# EAGLE design Gift card (EAGLE 6.5.0)
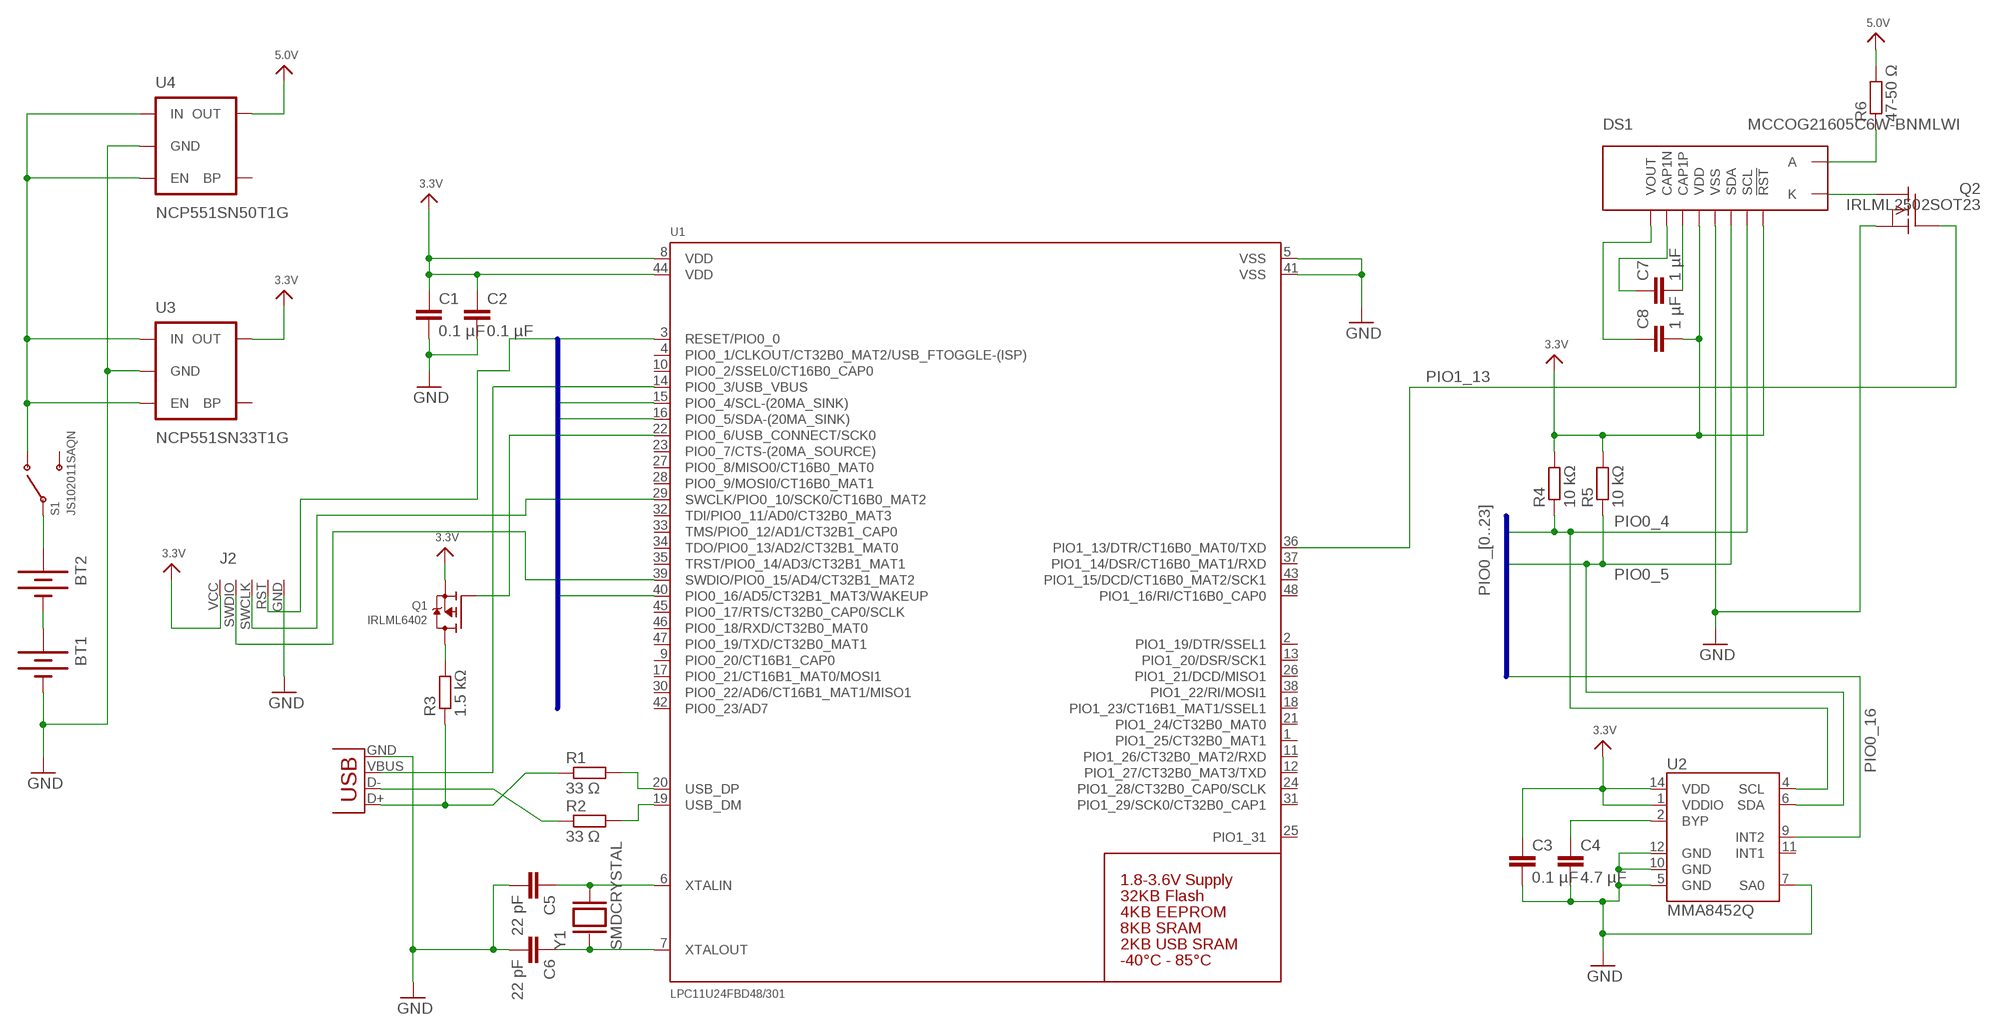
[diagram p0: schematic, sheet 1]

## Parts
BT1  BATTERY20SMD  [BATTCON_20MM]
BT2  BATTERY20SMD  [BATTCON_20MM]
C1  0.1 µF  C-EUC0805  [C0805]
C2  0.1 µF  C-EUC0805  [C0805]
C3  0.1 µF  C-EUC0805  [C0805]
C4  4.7 µF  C-EUC0805  [C0805]
C5  22 pF  C-EUC0805  [C0805]
C6  22 pF  C-EUC0805  [C0805]
C7  1 µF  C-EUC0805  [C0805]
C8  1 µF  C-EUC0805  [C0805]
DS1  MCCOG21605C6W-BNMLWI  [MCCOG21605C6W-BNMLWI]
J1  USBSMD  [USB-MINIB]
J2  LPC_SWD_PINPROG  [LPC_SWD_PINS]
Q1  IRLML6402  MOSFET-PWIDE  [SOT23-WIDE]
Q2  IRLML2502SOT23  [SOT23-3]
R1  33 Ω  R-EU_R0805  [R0805]
R2  33 Ω  R-EU_R0805  [R0805]
R3  1.5 kΩ  R-EU_R0805  [R0805]
R4  10 kΩ  R-EU_R0805  [R0805]
R5  10 kΩ  R-EU_R0805  [R0805]
R6  47-50 Ω  R-EU_R0805  [R0805]
S1  JS102011SAQN  [JS102011SAQN]
U1  LPC11U24FBD48/301  LPC11U24_QFP48  [LQFP48]
U2  MMA8452Q  [QFN-16_0.5MM]
U3  NCP551SN33T1G  V_REG_LDOSMD  [SOT23-5]
U4  NCP551SN50T1G  V_REG_LDOSMD  [SOT23-5]
Y1  SMDCRYSTAL  [XTAL_ABM7]

## Nets
3V3: C1.1 C2.1 C3.1 C8.2 DS1.P$4(VDD) DS1.P$8(!RST) J2.VCC Q1.2(S) R4.2 R5.2 U1.8(VDD) U1.44(VDD) U2.1(VDDIO) U2.14(VDD) U3.5(OUT) ; supply symbol labelled 3.3V
5V: R6.2 U4.5(OUT) ; supply symbol labelled 5.0V
GND: BT1.2(-) C1.2 C2.2 C3.2 C4.2 C5.2 C6.2 DS1.P$5(VSS) J1.GND J2.GND Q2.2(S) U1.5(VSS) U1.41(VSS) U2.5(GND) U2.7(SA0) U2.10(GND) U2.12(GND) U3.2(GND) U4.2(GND)
N$1: BT1.1(+) BT1.3(+) BT2.2(-)
N$2: J1.D+ R1.1 R3.1
N$3: R1.2 U1.20(USB_DP)
N$4: R2.2 U1.19(USB_DM)
N$5: J1.D- R2.1
N$6: Q1.3(D) R3.2
N$8: C5.1 U1.6(XTALIN) Y1.P$2
N$9: C6.1 U1.7(XTALOUT) Y1.P$1
N$10: DS1.K Q2.3(D)
N$11: BT2.1(+) BT2.3(+) S1.P$2
N$12: C7.1 DS1.P$2(CAP1N)
N$13: C7.2 DS1.P$3(CAP1P)
N$14: C8.1 DS1.P$1(VOUT)
N$15: C4.1 U2.2(BYP)
PIO0_0: J2.RST(!RST) U1.3(RESET/PIO0_0)
PIO0_3: J1.VBUS U1.14(PIO0_3/USB_VBUS)
PIO0_4: DS1.P$7(SCL) R4.1 U1.15(PIO0_4/SCL-(20MA_SINK)) U2.4(SCL)
PIO0_5: DS1.P$6(SDA) R5.1 U1.16(PIO0_5/SDA-(20MA_SINK)) U2.6(SDA)
PIO0_6: Q1.1(G) U1.22(PIO0_6/USB_CONNECT/SCK0)
PIO0_10: J2.SWCLK U1.29(SWCLK/PIO0_10/SCK0/CT16B0_MAT2)
PIO0_15: J2.SWDIO(SWD) U1.39(SWDIO/PIO0_15/AD4/CT32B1_MAT2)
PIO0_16: U1.40(PIO0_16/AD5/CT32B1_MAT3/WAKEUP) U2.9(INT2)
PIO1_13: Q2.1(G) U1.36(PIO1_13/DTR/CT16B0_MAT0/TXD)
VIN: S1.P$1 U3.1(IN) U3.3(EN) U4.1(IN) U4.3(EN)
VLED: DS1.A R6.1
Unconnected: S1.P$3 U1.1(PIO1_25/CT32B0_MAT1) U1.2(PIO1_19/DTR/SSEL1) U1.4(PIO0_1/CLKOUT/CT32B0_MAT2/USB_FTOGGLE-(ISP)) U1.9(PIO0_20/CT16B1_CAP0) U1.10(PIO0_2/SSEL0/CT16B0_CAP0) U1.11(PIO1_26/CT32B0_MAT2/RXD) U1.12(PIO1_27/CT32B0_MAT3/TXD) U1.13(PIO1_20/DSR/SCK1) U1.17(PIO0_21/CT16B1_MAT0/MOSI1) U1.18(PIO1_23/CT16B1_MAT1/SSEL1) U1.21(PIO1_24/CT32B0_MAT0) U1.23(PIO0_7/CTS-(20MA_SOURCE)) U1.24(PIO1_28/CT32B0_CAP0/SCLK) U1.25(PIO1_31) U1.26(PIO1_21/DCD/MISO1) U1.27(PIO0_8/MISO0/CT16B0_MAT0) U1.28(PIO0_9/MOSI0/CT16B0_MAT1) U1.30(PIO0_22/AD6/CT16B1_MAT1/MISO1) U1.31(PIO1_29/SCK0/CT32B0_CAP1) U1.32(TDI/PIO0_11/AD0/CT32B0_MAT3) U1.33(TMS/PIO0_12/AD1/CT32B1_CAP0) U1.34(TDO/PIO0_13/AD2/CT32B1_MAT0) U1.35(TRST/PIO0_14/AD3/CT32B1_MAT1) U1.37(PIO1_14/DSR/CT16B0_MAT1/RXD) U1.38(PIO1_22/RI/MOSI1) U1.42(PIO0_23/AD7) U1.43(PIO1_15/DCD/CT16B0_MAT2/SCK1) U1.45(PIO0_17/RTS/CT32B0_CAP0/SCLK) U1.46(PIO0_18/RXD/CT32B0_MAT0) U1.47(PIO0_19/TXD/CT32B0_MAT1) U1.48(PIO1_16/RI/CT16B0_CAP0) U2.11(INT1) U3.4(BP) U4.4(BP)

## Buses
PIO0_[0..23]

## Library data of the parts
BT1 BT2 = SparkFun-Electromechanical:BATTERY: Battery Holders Various common sizes : AA, AAA, 20mm coin cell and 12mm coin cell.
C1-C8 = rcl:C-EU: CAPACITOR, European symbol
DS1 = jenswilly_custom:MCCOG21605C6W-BNMLWI: MCCOG21605C6W-BNMLWI 16 x 2 white-on-blue backlit LCD display based on a I2C ST7032 controller.
J1 = SparkFun-Connectors:USB: USB Connectors USB-B-PTH is fully proven SKU : PRT-00139 USB-miniB is fully proven SKU : PRT-00587 USB-A-PCB is untested. USB-A-H is throughly reviewed, but untested. Spark Fun Electronics SKU : PRT-00437 USB-B-SMT is throughly reviewed, but untested. Needs silkscreen touching up. USB-A-S has not been used/tested USB-MB-H has not been used/tested
J2 = jenswilly_custom:LPC_SWD_PINPROG
Q1 = microbuilder:MOSFET-P: P-Channel Mosfet LEGEND VDS: Voltage Drain-Source ID: Drain Current RDS(ON): Drain-Source On-State Resistance VGS(TH): Gate-Source Threshold Voltage CISS: Drain-Source Input Capacitance SOT-23 Name VDS ID RDS(ON) VGS(TH) CISS Order Number IRLML5103 30V 760mA 600 mOhm -- 75pF @ 25V Digikey: IRLML5103PBFCT-ND IRLML6401 12V 4.3A 50 mOhm 950mV @ 250µA 830pF @ 10V Digikey: IRLML6401PBFTR-ND NTR0202PL 20V 400mA 800 mOhm 2.3V @ 250uA 70pF @ 5V Digikey: NTR0202PLT1GOSTR-ND NTR4101PT1G 20V 1.8A 85 mOhm 1.2V @ 250uA 675pF @ 10V Digikey: NTR4101PT1GOSCT-ND DMP2004K 20V 600mA 900 mOhm 1V @ 250uA 175pF @ 16V Digikey: DMP2004KDICT-ND PMV65XP 20V 3.9A 76 mOhm 950mV @ 1mA 725pF @ 20V Digikey: 568-2358-2-ND TO-252 Name VDS ID RDS(ON) VGS(TH) CISS Order Number AOD417 30V 25A 34 mOhm 3V @ 250µA 920pF @ 15V Digikey: 785-1106-2-ND
Q2 = jenswilly_custom:IRLML2502: IRLML2502PbF HEXFET Power MOSFET N-channel MOSFET Vdss 20V Rds(on) 0.045? Vgs(th), max 1.2V Datasheet: http://www.irf.com/product-info/datasheets/data/irlml2502.pdf
R1-R6 = rcl:R-EU_: RESISTOR, European symbol
S1 = jenswilly_custom:JS102011SAQN: JS102011SAQN SPDT slide switch.
U1 = microbuilder:LPC11U24_QFP48: LPC11U24 - ARM Cortex M0 50MHz MCU Supply: 1.8-3.6V Flash: 32KB EEPROM: 4KB SRAM: 8KB + 2KB USB Temp: -40°C - 85°C
U2 = SparkFun-Sensors:MMA8452Q: MMA8452Q 3-Axis, 12/8-bit Digital Accelerometer Supply Voltage: 1.6-3.6V Range: +/- 2g, 4g, 8g Interface: I2C, 12-bit and 8-bit ODR: 1.56 Hz - 800 Hz Package: QFN-16 http://cache.freescale.com/files/sensors/doc/data_sheet/MMA8452Q.pdf
U3 U4 = SparkFun-PowerIC:V_REG_LDO: Voltage Regulator LDO Standard 150mA LDO voltage regulator in SOT-23 layout. Micrel part MIC5205. BP (by-pass) pin is used to lower output noise with 470pF cap.
Y1 = jenswilly_custom:SMDCRYSTAL: SMD Crystal

## Board
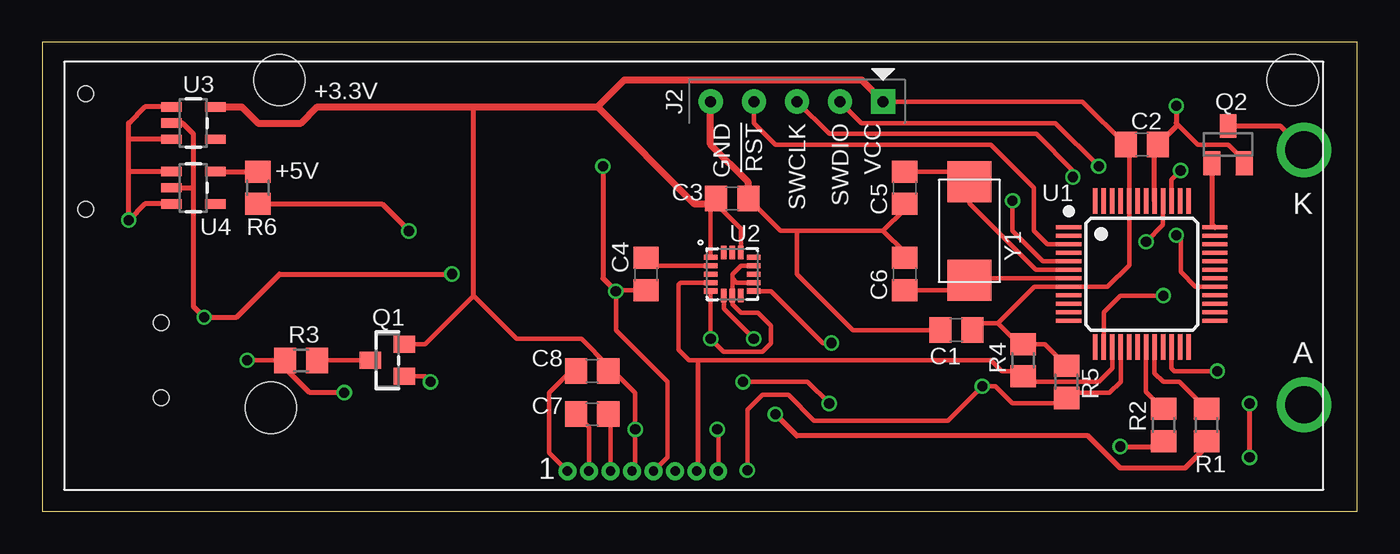
[diagram p1: board, top side]
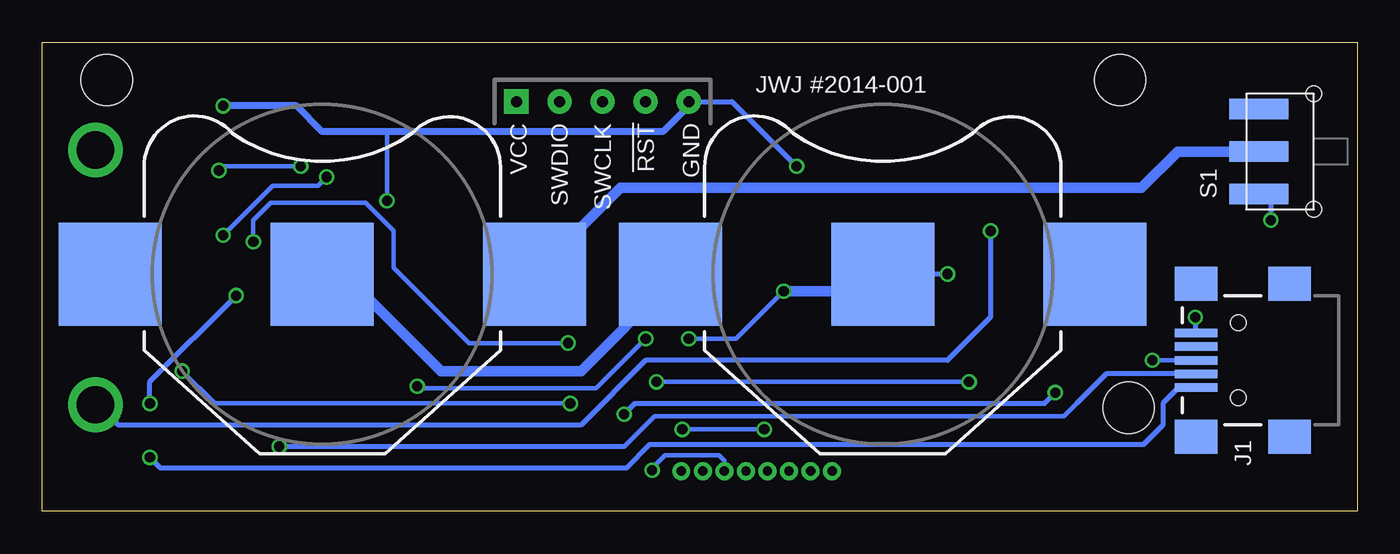
[diagram p2: board, bottom side, seen from below]

Size 77.45 x 27.61 mm. Coordinates in mm from the lower left corner, seen from the top.
Outline: 0,0 77.45,0 77.45,27.61 0,27.61 0,0
Copper layers (1*16): Top 0.035mm / dielectric 1.5mm / Bottom 0.035mm
Design rules "ITEADstudio_DRC": minimum track width 6mil, minimum drill 12mil, track to track 6mil, track to pad 6mil, pad to pad 6mil, via to via 6mil, smd to smd 0mil, copper to edge 10mil, drill to drill 10mil, minimum pad ring 10mil, minimum via ring 6mil, stop-mask expansion 2mil, vias tented up to drill 100mil, thermal gap 10mil
Holes 3 mm at 13.97,25.4 73.66,25.4 13.46,6.1

### Footprints (pad centres in the part's own frame; a part is rotated, then mirrored left to right if it is on the bottom)
BATTCON_20MM = smd 6.07 x 6.07: 1 -12.5,0; 2 0,0; 3 12.5,0
C0805 = smd 1.3 x 1.5: 1 -0.95,0; 2 0.95,0
MCCOG21605C6W-BNMLWI = drill 2.2: A 73.05,5; K 73.05,20 | drill 0.55: P$1 29.655,1.1; P$2 30.925,1.1; P$3 32.195,1.1; P$4 33.465,1.1; P$5 34.735,1.1; P$6 36.005,1.1; P$7 37.275,1.1; P$8 38.545,1.1
USB-MINIB = smd 2.5 x 0.5: D+ 2.5,0; D- 2.5,0.8; GND 2.5,-1.6; ID 2.5,-0.8; VBUS 2.5,1.6 | smd 2.5 x 2: MTN1 -3,4.5; MTN2 2.5,4.5; MTN3 -3,-4.5; MTN4 2.5,-4.5 | hole 0.9: 0,2.2; 0,-2.2
LPC_SWD_PINS = drill 0.65 pad 1.422: GND 5.08,0; RST 2.54,0; SWCLK 0,0; SWDIO -2.54,0 | drill 0.65 pad 1.422 square: VCC -5.08,0
SOT23-WIDE = smd 1 x 1.27: 1 -0.95,-1; 2 0.95,-1; 3 0,1
SOT23-3 = smd 1 x 1.4: 1 -0.95,-1.1; 2 0.95,-1.1; 3 0,1.1
R0805 = smd 1.3 x 1.5: 1 -0.95,0; 2 0.95,0
JS102011SAQN = smd 1.2 x 3.5: P$1 0.9,3.25; P$2 3.4,3.25; P$3 5.9,3.25 | hole 0.9: 0,0; 6.8,0
LQFP48 = smd 1.5 x 0.25: 1 -4.3,2.75; 2 -4.3,2.25; 3 -4.3,1.75; 4 -4.3,1.25; 5 -4.3,0.75; 6 -4.3,0.25; 7 -4.3,-0.25; 8 -4.3,-0.75; 9 -4.3,-1.25; 10 -4.3,-1.75; 11 -4.3,-2.25; 12 -4.3,-2.75; 25 4.3,-2.75; 26 4.3,-2.25; 27 4.3,-1.75; 28 4.3,-1.25; 29 4.3,-0.75; 30 4.3,-0.25; 31 4.3,0.25; 32 4.3,0.75; 33 4.3,1.25; 34 4.3,1.75; 35 4.3,2.25; 36 4.3,2.75 | smd 0.25 x 1.5: 13 -2.75,-4.3; 14 -2.25,-4.3; 15 -1.75,-4.3; 16 -1.25,-4.3; 17 -0.75,-4.3; 18 -0.25,-4.3; 19 0.25,-4.3; 20 0.75,-4.3; 21 1.25,-4.3; 22 1.75,-4.3; 23 2.25,-4.3; 24 2.75,-4.3; 37 2.75,4.3; 38 2.25,4.3; 39 1.75,4.3; 40 1.25,4.3; 41 0.75,4.3; 42 0.25,4.3; 43 -0.25,4.3; 44 -0.75,4.3; 45 -1.25,4.3; 46 -1.75,4.3; 47 -2.25,4.3; 48 -2.75,4.3
QFN-16_0.5MM = smd 0.8 x 0.3: 1 -1.275,1; 2 -1.275,0.5; 3 -1.275,0; 4 -1.275,-0.5; 5 -1.275,-1; 9 1.275,-1; 10 1.275,-0.5; 11 1.275,0; 12 1.275,0.5; 13 1.275,1 | smd 0.3 x 0.8: 6 -0.5,-1.275; 7 0,-1.275; 8 0.5,-1.275; 14 0.5,1.275; 15 0,1.275; 16 -0.5,1.275
SOT23-5 = smd 0.55 x 1.2: 1 -0.95,-1.3; 2 0,-1.3; 3 0.95,-1.3; 4 0.95,1.3; 5 -0.95,1.3
XTAL_ABM7 = smd 2.4 x 2.6: P$1 -2.9,0; P$2 2.9,0

### Placement (x,y rotation side)
BT1  27.94,13.97 0 bottom
BT2  60.96,13.97 0 bottom
C1  53.85,10.67 180 top
C2  64.77,21.59 0 top
C3  40.64,18.41 0 top
C4  35.56,13.97 270 top
C5  50.8,19.05 270 top
C6  50.8,13.97 90 top
C7  32.38,5.71 0 top
C8  32.38,8.26 0 top
DS1  1.27,1.27 0 top
J1  6.99,8.89 180 bottom
J2  44.45,24.13 180 top
Q1  20.32,8.89 90 top
Q2  69.85,21.59 0 top
R1  68.58,5.08 90 top
R2  66.04,5.08 90 top
R3  15.24,8.89 0 top
R4  57.78,8.89 90 top
R5  60.33,7.62 90 top
R6  12.7,19.05 90 top
S1  2.54,17.78 90 bottom
U1  64.77,13.97 0 top
U2  40.64,13.97 0 top
U3  8.89,22.86 270 top
U4  8.89,19.05 270 top
Y1  54.61,16.51 90 top

### Tracks (layer width: path | path; a pad name or v marks a point on that pad's centre or on a via)
3V3  (via drill 0.6)
  Top 0.254: U2.1 39.37,18.09 C3.1 40.01,18.1 40.01,17.78 41.14,16.64 U2.14 | DS1.P$4 34.92,2.56 v34.92,4.83 34.92,6.99 33.66,8.26 C8.2 33.34,8.57 31.75,10.16 27.94,10.16 25.4,12.7 22.54,9.84 Q1.2 | R5.2 59.05,9.84 R4.2 57.91,9.97 57.41,9.97 56.29,11.08 | J2.VCC 61.28,24.13 C2.1 64.02,21.39 U1.44 64.02,14.49 62.75,13.22 U1.8 58.43,13.22 56.29,11.08 | C1.1 55.21,11.08 56.29,11.08 | DS1.P$8 39.81,4.76 v39.75,4.83
  Top 0.305: 25.4,12.7 25.4,23.81
  Top 0.406: 32.7,23.81 25.4,23.81 16.19,23.81 15.24,22.86 12.7,22.86 11.75,23.81 U3.5 | 32.7,23.81 34.29,25.4 48.26,25.4 J2.VCC | 39.37,18.09 38.42,18.09 32.7,23.81
  Bottom 0.254: v34.92,4.83 v39.75,4.83
5V
  Top 0.305: U4.5 R6.2
GND  (via drill 0.6)
  Top 0.254: 36.01,12.57 C4.2 33.85,13.02 v33.78,12.95 33.78,10.67 36.83,7.62 36.83,3.19 DS1.P$5 | U2.5 v39.37,10.16 40.13,9.4 42.42,9.4 42.93,9.91 42.93,10.92 42.16,11.68 41.15,11.68 40.64,12.19 U2.7 40.64,13.72 | 40.64,13.72 40.64,13.97 41.14,14.47 U2.12 | U2.10 40.89,13.47 40.64,13.72 | C1.2 47.75,10.67 44.45,13.97 44.45,16.51 | C5.2 50.8,17.78 49.53,16.51 | 49.53,16.51 44.45,16.51 | 44.45,16.51 43.49,16.51 C3.2 | C6.2 50.8,15.24 49.53,16.51 | Q2.2 70.8,20.64 69.85,21.59 68.07,21.59 66.8,22.86 | U1.5 58.94,14.72 57.15,16.51 v57.15,18.29
  Top 0.305: U3.2 8.26,22.86 8.89,22.23 8.89,19.05 | 8.89,19.05 8.89,12.06 v9.53,11.43 11.43,11.43 13.97,13.97 v24.13,13.97 | U4.2 8.89,19.05 | v33.02,20.32 33.02,13.72 v33.78,12.95 | v66.8,23.88 66.8,22.86 66.8,22.67 C2.2 65.52,21.39 U1.41
  Top 0.406: C3.2 41.59,19.37 39.37,21.59 J2.GND
  Bottom 0.254: 28.96,12.95 BT1.2 | v39.37,10.16 36.58,10.16 v33.78,12.95 | v57.15,18.29 57.15,22.35
  Bottom 0.305: v9.53,11.43 9.53,10.53 J1.GND | v24.13,13.97 BT1.2 | J2.GND 36.83,24.13 v33.02,20.32
  Bottom 0.406: J2.GND 39.37,23.88 40.89,22.35 57.15,22.35 60.96,22.35 62.48,23.88 v66.8,23.88
  Bottom 0.61: v33.78,12.95 28.96,12.95
N$1
  Bottom 0.61: 40.44,13.54 45.72,8.26 53.98,8.26 59.69,13.97
  Bottom 1.016: 40.44,13.54 BT1.1 | 59.69,13.97 BT2.2
N$2  (via drill 0.6)
  Top 0.254: v12.06,8.89 R3.1
  Top 0.305: R1.1 68.58,3.81 67.31,2.54 63.5,2.54 61.59,4.45 44.45,4.45 v43.18,5.71 | v17.78,6.99 15.75,6.99 14.48,8.26 14.48,8.7 R3.1
  Bottom 0.254: J1.D+ v12.06,8.89
  Bottom 0.305: v43.18,5.71 42.55,6.35 18.41,6.35 v17.78,6.99
N$3
  Top 0.254: U1.20 65.52,8.14 66.04,7.62 66.99,7.62 R1.2
N$4
  Top 0.254: U1.19 65.02,7.05 R2.2
N$5  (via drill 0.6)
  Top 0.305: v63.5,3.81 65.72,3.81 R2.1
  Bottom 0.254: 43.18,3.81 41.4,5.59 17.27,5.59 16.51,6.35
  Bottom 0.305: J1.D- 14.77,8.09 16.51,6.35 | 43.18,3.81 v63.5,3.81
N$6
  Top 0.254: Q1.3 R3.2
N$8
  Top 0.254: U1.6 58.53,14.22 54.61,18.14 Y1.P$2 54.02,20 C5.1
N$9
  Top 0.254: U1.7 55.99,13.72 Y1.P$1 54.02,13.02 C6.1
N$10
  Top 0.305: Q2.3 72.9,22.69 DS1.K
N$11
  Bottom 0.61: S1.P$2 10.57,21.18 12.7,19.05 43.38,19.05 BT2.3
N$12
  Top 0.254: C7.1 32.2,4.96 DS1.P$2
N$13
  Top 0.254: C7.2 33.47,5.58 DS1.P$3
N$14
  Top 0.254: C8.1 31.11,8.26 29.84,6.99 29.84,3.45 DS1.P$1
N$15
  Top 0.254: U2.2 36.01,14.47 C4.1
PIO0_0
  Top 0.254: J2.RST 41.91,22.86 43.18,21.59 55.88,21.59 58.42,19.05 58.42,16.51 59.21,15.72 U1.3
PIO0_3  (via drill 0.6)
  Top 0.254: v66.04,12.7 63.5,12.7 62.52,11.72 U1.14
  Top 0.305: v71.12,3.17 v71.12,6.35
  Bottom 0.305: v71.12,3.17 70.48,2.54 43.05,2.54 41.66,3.94 12.57,3.94 11.43,5.08 11.43,6.35 10.49,7.29 J1.VBUS | v71.12,6.35 71.12,7.62 v66.04,12.7
PIO0_4
  Top 0.254: U1.15 63.02,8.41 62.23,7.62 58.1,7.62 R4.1 57.47,8.26 56.52,8.26 55.88,8.89 38.61,8.89 | U2.4 37.6,13.47 37.47,13.34 37.47,9.53 38.1,8.89 38.61,8.89 | DS1.P$7 38.61,2.37 38.61,8.89
PIO0_5  (via drill 0.6)
  Top 0.254: U1.16 63.52,7.64 62.87,6.99 60.64,6.99 R5.1 60.01,6.35 57.15,6.35 56.13,7.37 v55.37,7.37 53.34,5.33 45.47,5.33 43.94,6.86 42.42,6.86 41.53,5.97 v41.53,2.41 | U2.6 40.14,11.93 v41.91,10.16
  Bottom 0.254: v41.91,10.16 44.83,7.24 54.99,7.24 v55.37,7.37 | 37.27,2.86 DS1.P$6 37.27,2.98 37.59,3.3 40.77,3.3 41.53,2.54 v41.53,2.41
PIO0_6  (via drill 0.6)
  Top 0.254: Q1.1 22.54,7.94 v22.86,7.62 | v41.27,7.62 45.09,7.62 v46.35,6.35 | U1.22 66.52,8.41 66.67,8.26 v69.22,8.26
  Bottom 0.254: v22.86,7.62 v41.27,7.62 | v46.35,6.35 67.31,6.35 v69.22,8.26
PIO0_10  (via drill 0.6)
  Top 0.254: J2.SWCLK 46.35,22.23 58.55,22.23 60.71,20.07 v60.71,19.68 | v66.8,16.26 67.06,16 67.06,14.1 67.93,13.22 U1.29
  Bottom 0.254: v60.71,19.68 61.21,19.18 63.88,19.18 v66.8,16.26
PIO0_15  (via drill 0.6)
  Top 0.254: J2.SWDIO 48.26,22.86 59.69,22.86 v62.23,20.32 | 66.8,19.81 v67.06,20.07 66.52,19.53 U1.39
  Bottom 0.254: v62.23,20.32 66.8,20.32 v67.06,20.07
PIO0_16  (via drill 0.6)
  Top 0.254: U2.9 42.91,12.97 45.97,9.91 v46.48,9.91 | U1.40 66.02,16.87 v65.02,15.88
  Bottom 0.254: v46.48,9.91 52.32,9.91 56.77,14.35 56.77,16.51 58.42,18.16 64.01,18.16 65.02,17.14 v65.02,15.88
PIO1_13
  Top 0.305: Q2.1 68.9,16.89 U1.36
VIN  (via drill 0.6)
  Top 0.305: 5.08,20 v5.08,17.14 6.04,18.1 U4.3 | 5.08,20 5.08,21.91 | 5.08,21.91 5.08,22.86 6.03,23.81 U3.1 | U3.3 5.08,21.91 | U4.1 5.08,20
  Bottom 0.305: 5.08,18.68 v5.08,17.14
  Bottom 0.406: S1.P$1 5.08,18.68
VLED  (via drill 0.6)
  Top 0.305: R6.1 20,18.1 v21.59,16.51
  Bottom 0.305: v21.59,16.51 21.59,11.43 24.13,8.89 41.91,8.89 45.72,5.08 72.96,5.08 74.15,6.27 DS1.A

### Text on the board
tPlace: +3.3V | +5V
bPlace: JWJ #2014-001 | GND | !RST | SWCLK | SWDIO | VCC